# EasyEDA Pro project RFID_Auth_ESP32_Achyuth_PCB_chargeMOD.epro

# Board 1-PCB_PCB_RFID_Auth_ESP32
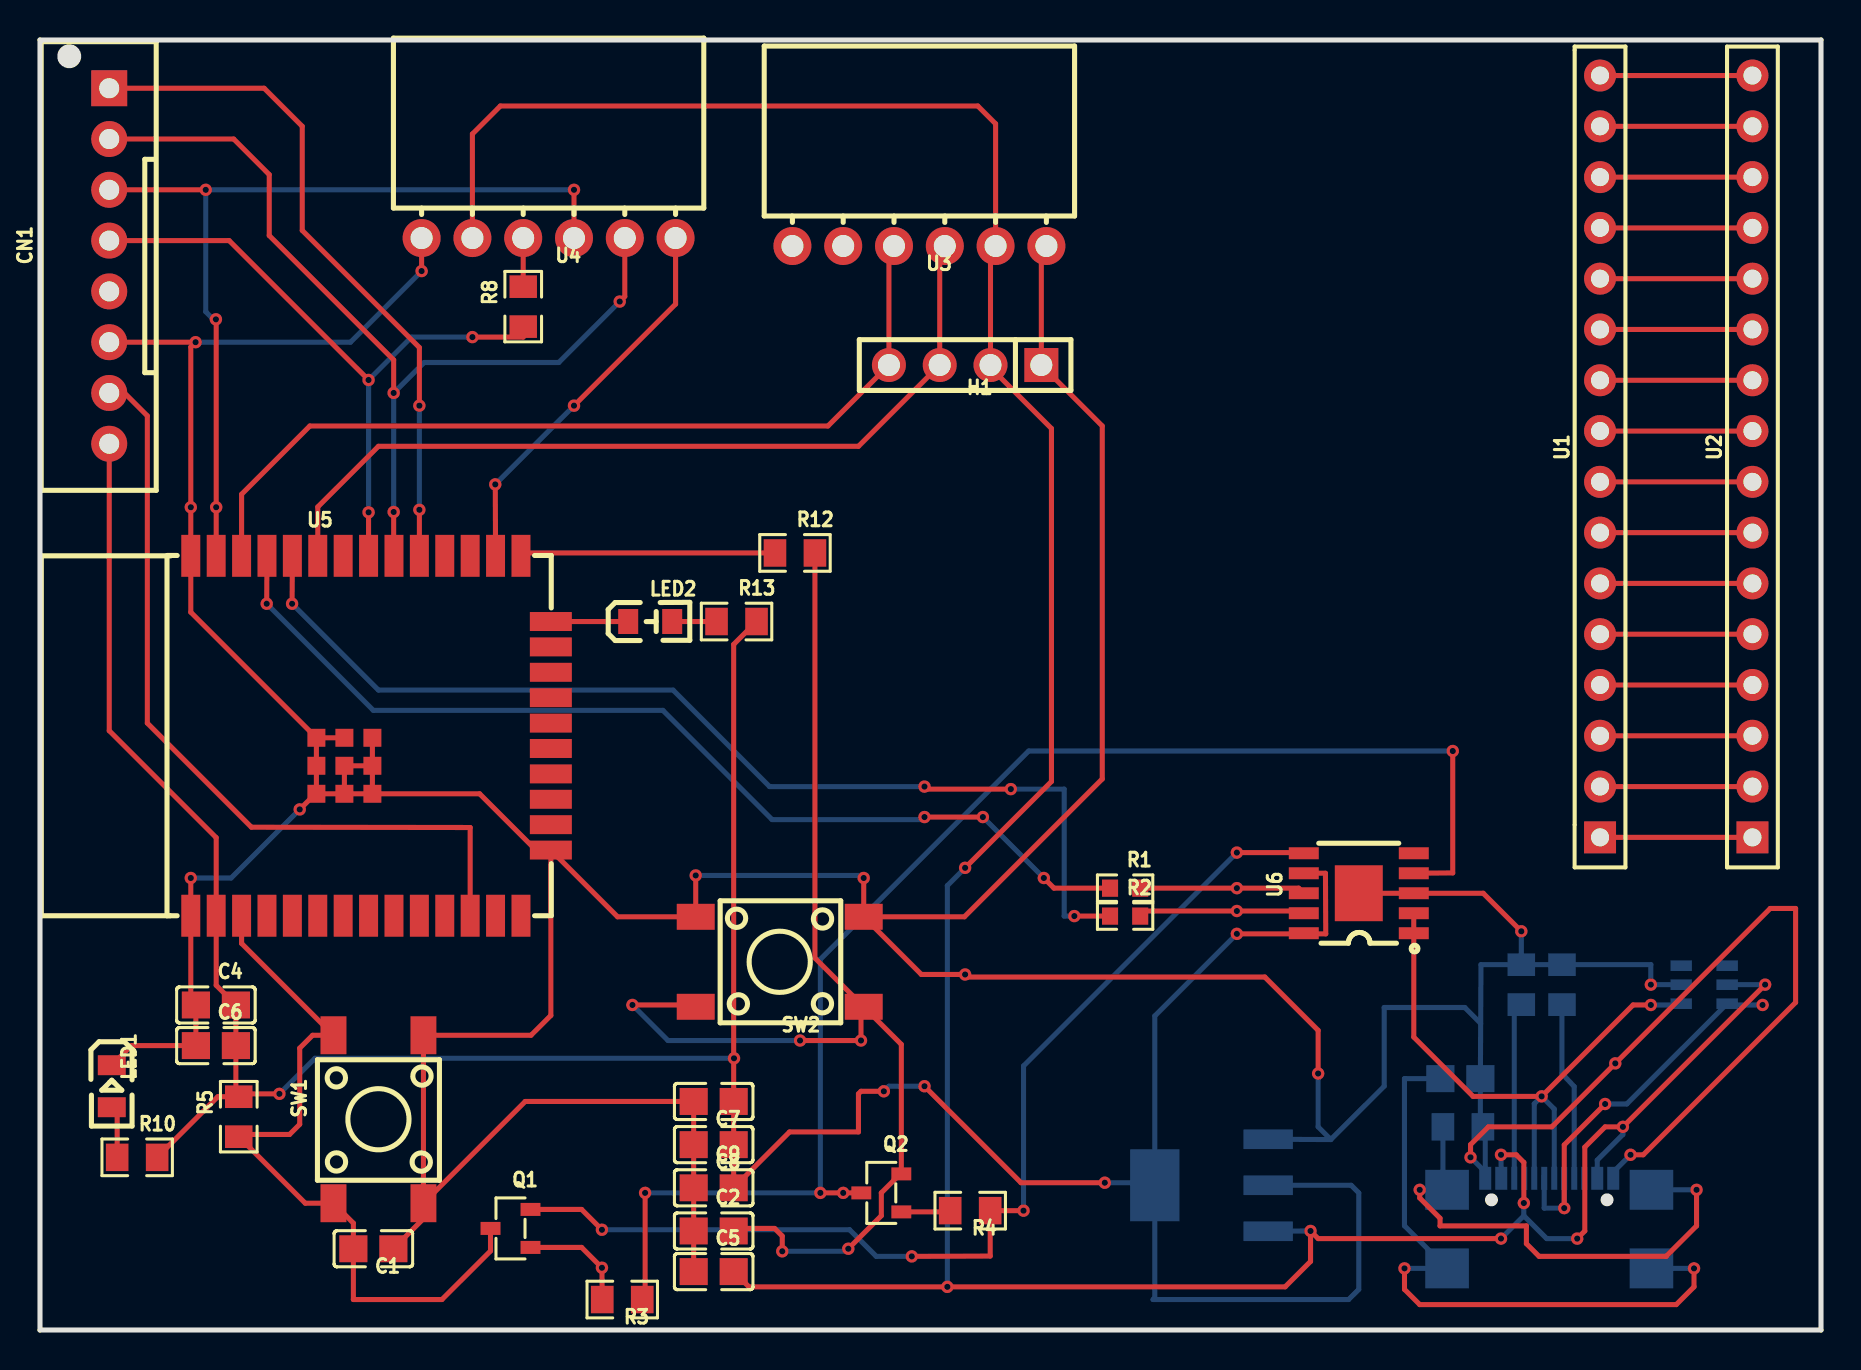
[diagram p0: board, top side]
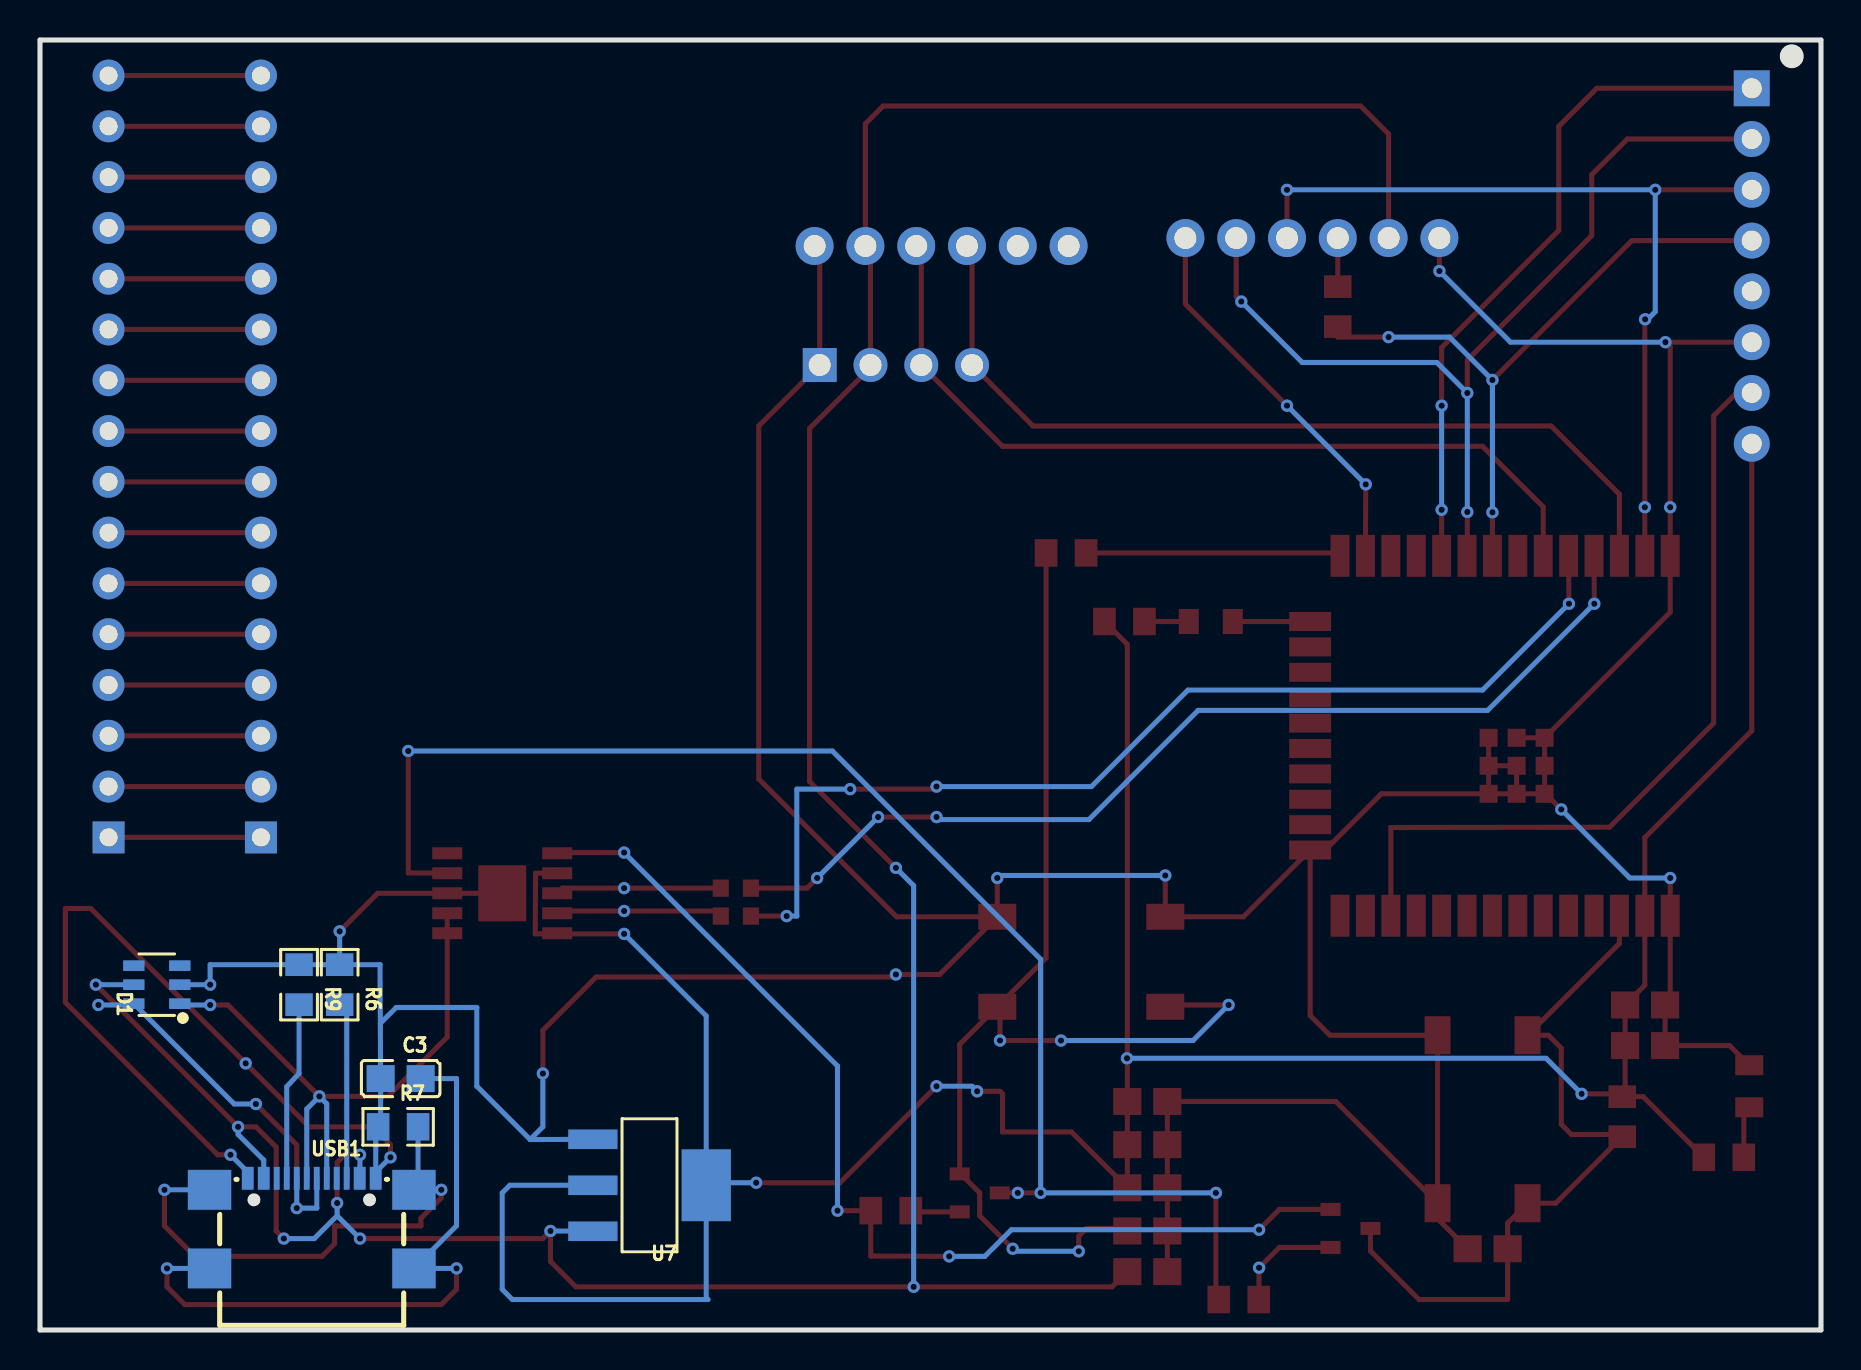
[diagram p1: board, bottom side, seen from below]

Outline 89.06 x 64.52 mm; copper layers: Top Layer, Inner1, Inner2, Bottom Layer. Coordinates in mm from the lower left corner of the outline.
Outline path: 0,64.52 89.06,64.52 89.06,0 0,0 0,64.52
Stack: Top Layer 0.035mm / Bottom Layer 0.035mm

## Design rules (mm)
spacing Default (default): track to track 0.102, other pairs 0 to 0.3
track width Default (default): min 0.254, default 0.254, max 25.4
differential pair differentialPair (default): width min 0.127, default 2.54, max 2.54; gap min 0.127, default 0.152

## Placement (name value [footprint] x y rotation side)
C1  100nF  [C0805]  16.67 4.06 180 top
C2  100nF  [C0805]  33.69 4.95 0 top
C3  10nF  [C0805]  71.03 12.57 180 bottom
C4  100nF  [C0805]  8.8 16.26 0 top
C5  10uF  [C0805]  33.69 2.92 0 top
C6  22uF  [C0805]  8.8 14.22 0 top
C7  100nF  [C0805]  33.69 11.43 180 top
C8  100nF  [C0805]  33.69 9.27 180 top
C9  10uF  [C0805]  33.69 7.11 0 top
CN1  B8B-XH-AM (LF)(SN)  [CONN-TH_B8B-XH-AM-LF-SN]  3.46 53.21 90 top
D1  SRV05-4_C2836319  [SOT-23-6_L2.9-W1.6-P0.95-LS2.8-BL]  83.22 17.27 90 bottom
H1  2.54-1*4P母  [HDR-TH_4P-P2.54-V-F]  46.26 48.26 180 top
LED1  0805G (Green)  [LED0805-R-RD]  3.59 12.19 270 top
LED2  FC-2012HRK-620D  [LED0805-RD]  30.51 35.43 0 top
Q1  SS8050-G  [SOT-23-3_L2.9-W1.3-P1.90-LS2.4-BR]  23.53 5.08 0 top
Q2  SS8050-G  [SOT-23-3_L2.9-W1.3-P1.90-LS2.4-BR]  42.07 6.86 0 top
R1  0Ω  [R0603]  54.26 22.1 0 top
R2  0Ω  [R0603]  54.26 20.7 0 top
R3  10kΩ  [R0805]  29.12 1.52 180 top
R4  10kΩ  [R0805]  46.51 5.97 180 top
R5  10kΩ  [R0805]  9.94 10.67 90 top
R6  5.1kΩ  [R0805]  74.07 17.27 270 bottom
R7  1MΩ  [R0805]  71.15 10.16 180 bottom
R8  220Ω  [R0805]  24.16 51.18 90 top
R9  5.1kΩ  [R0805]  76.11 17.27 270 bottom
R10  5.1kΩ  [R0805]  4.86 8.64 0 top
R12  22Ω  [R0805]  37.75 38.86 0 top
R13  560Ω  [R0805]  34.83 35.43 0 top
SW1  PTS645SH50SMTR92LFS  [KEY-SMD_4P-L6.0-W6.0-P4.50-LS9.0]  16.92 10.54 90 top
SW2  PTS645SH50SMTR92LFS  [KEY-SMD_4P-L6.0-W6.0-P4.50-LS9.0]  36.99 18.41 180 top
U1  ZX-PM2.54-1-16PY  [HDR-TH_16P-P2.54-V-F-1]  78.01 43.69 90 top
U2  ZX-PM2.54-1-16PY  [HDR-TH_16P-P2.54-V-F-1]  85.63 43.69 90 top
U3  PM254-1-06-W-8.5  [HDR-TH_6P-P2.54-H-F-W10.0-N]  43.97 54.21 180 top
U4  PM254-1-06-W-8.5  [HDR-TH_6P-P2.54-H-F-W10.0-N]  25.43 54.61 180 top
U5  ESP32-WROOM-32E(8MB)  [WIFI-SMD_ESP32-WROOM-32E]  16.54 29.72 0 top
U6  CH340K  [ESOP-10_L4.9-W3.9-P1.00-LS6.2-BL-EP]  65.95 21.84 90 top
U7  AMS1117-3.3_C347222  [SOT-223-4_L6.5-W3.5-P2.30-LS7.0-BR]  58.58 7.24 0 bottom
USB1  USB4110-GF-A  [USB-C-SMD_TYPE-C-16P-USB4110-GF-A]  75.47 5.33 180 bottom

## Footprints (pads in the part's own frame, mm; a bottom-side part is the same pattern mirrored in y, then rotated)
C0805
  rect 1.41x1.35 smd: 1(-1,0) 2(1,0)
CONN-TH_B8B-XH-AM-LF-SN
  rect 1.8x1.8 hole 1: 1(8.89,0)
  round 1.8 hole 1: 2(6.35,0) 3(3.81,0) 4(1.27,0) 5(-1.27,0) 6(-3.81,0) 7(-6.35,0) 8(-8.89,0)
ESOP-10_L4.9-W3.9-P1.00-LS6.2-BL-EP
  rect 0.6x1.5 smd: 1(-2.001,-2.75) 2(-1,-2.75) 3(-0.001,-2.75) 4(1,-2.75) 5(2,-2.75) 6(2,2.75) 7(1,2.75) 8(-0.001,2.75) 9(-1,2.75) 10(-2.001,2.75)
  rect 2.8x2.4 smd: 11(-0.001,0)
HDR-TH_4P-P2.54-V-F
  rect 1.7x1.7 hole 1.1: 1(-3.81,0)
  round 1.7 hole 1.1: 2(-1.27,0) 3(1.27,0) 4(3.81,0)
HDR-TH_6P-P2.54-H-F-W10.0-N
  round 1.9 hole 1.1: 1(-6.35,0) 2(-3.81,0) 3(-1.27,0) 4(1.27,0) 5(3.81,0) 6(6.35,0)
HDR-TH_16P-P2.54-V-F-1
  rect 1.6x1.6 hole 0.9: 1(-19.05,0)
  round 1.6 hole 0.9: 2(-16.509,0) 3(-13.97,0) 4(-11.43,0) 5(-8.889,0) 6(-6.349,0) 7(-3.809,0) 8(-1.27,0) 9(1.27,0) 10(3.811,0) 11(6.351,0) 12(8.89,0) 13(11.431,0) 14(13.97,0) 15(16.511,0) 16(19.05,0)
KEY-SMD_4P-L6.0-W6.0-P4.50-LS9.0
  rect 1.9x1.3 smd: 1(-4.2,2.25) 2(4.2,2.25) 3(-4.2,-2.25) 4(4.2,-2.25)
LED0805-R-RD
  rect 1x1.399 smd: 1(1.05,0) 2(-1.05,0)
LED0805-RD
  rect 1x1.25 smd: 1(-1.1,0) 2(1.1,0)
R0603
  rect 0.806x0.864 smd: 1(-0.753,0) 2(0.753,0)
R0805
  rect 1.133x1.377 smd: 1(-1,0) 2(1,0)
SOT-23-3_L2.9-W1.3-P1.90-LS2.4-BR
  rect 1x0.65 smd: 1(1,-0.95) 2(1,0.95) 3(-1,0)
SOT-23-6_L2.9-W1.6-P0.95-LS2.8-BL
  rect 0.532x1.072 smd: 1(-0.95,-1.149) 2(0,-1.149) 3(0.95,-1.149) 4(0.95,1.149) 5(0,1.149) 6(-0.95,1.149)
SOT-223-4_L6.5-W3.5-P2.30-LS7.0-BR
  rect 2.47x0.98 smd: 1(2.835,-2.3) 2(2.835,0) 3(2.835,2.3)
  rect 2.47x3.6 smd: 4(-2.835,0)
USB-C-SMD_TYPE-C-16P-USB4110-GF-A
  rect 2.18x2 smd: 8(-5.11,1.677) 9(5.11,1.677) 10(-5.11,-2.252) 11(5.11,-2.252)
  rect 0.6x1.15 smd: A1B12(-3.2,2.252) A4B9(-2.4,2.252) B1A12(3.2,2.252) B4A9(2.4,2.252)
  rect 0.3x1.15 smd: A5(-1.25,2.252) A6(-0.25,2.252) A7(0.25,2.252) A8(1.25,2.252) B5(1.75,2.252) B6(0.75,2.252) B7(-0.75,2.252) B8(-1.75,2.252)
WIFI-SMD_ESP32-WROOM-32E
  rect 0.95x2.1 smd: 1(-9.002,-9) 2(-7.732,-9) 3(-6.463,-9) 4(-5.192,-9) 5(-3.922,-9) 6(-2.652,-9) 7(-1.383,-9) 8(-0.113,-9) 9(1.157,-9) 10(2.428,-9) 11(3.697,-9) 12(4.968,-9) 13(6.237,-9) 14(7.508,-9) 25(7.508,9) 26(6.237,9) 27(4.968,9) 28(3.697,9) 29(2.428,9) 30(1.157,9) 31(-0.113,9) 32(-1.383,9) 33(-2.652,9) 34(-3.922,9) 35(-5.192,9) 36(-6.463,9) 37(-7.732,9) 38(-9.002,9)
  rect 2.1x0.95 smd: 15(9.002,-5.715) 16(9.002,-4.445) 17(9.002,-3.175) 18(9.002,-1.905) 19(9.002,-0.635) 20(9.002,0.635) 21(9.002,1.905) 22(9.002,3.175) 23(9.002,4.445) 24(9.002,5.715)
  rect 0.9x0.9 smd: 39(-2.721,-0.1) 39(-2.721,-1.5) 39(-2.721,-2.9) 39(-1.321,-0.1) 39(-1.321,-1.5) 39(-1.321,-2.9) 39(0.079,-0.1) 39(0.079,-1.5) 39(0.079,-2.9)

## Nets
+3V3: C4.2 C6.2 C7.1 C8.1 C9.2 CN1.8 R5.2 R10.2 R13.2 U5.2 U6.7 U6.10 U7.2 U7.4
+5V: C5.2 D1.5 H1.2 U3.2 U4.5 U7.3 USB1.A4B9 USB1.B4A9
GND: C1.1 C2.1 C3.1 C4.1 C5.1 C6.1 C7.2 C8.2 C9.1 CN1.6 D1.2 H1.1 LED1.2 R6.1 R7.1 R9.1 SW1.3 SW1.4 SW2.3 SW2.4 U3.1 U4.6 U5.1 U5.15 U5.38 U5.39 U6.3 U6.11 U7.1 USB1.A1B12 USB1.B1A12
DTR: Q2.3 R3.1 U6.4
EN: C1.2 Q1.3 R5.1 SW1.1 SW1.2 U5.3
IO0_BTN: C2.2 Q2.2 R12.2 SW2.1 SW2.2
IO2: LED2.1 U5.24
MISO: CN1.4 R8.1 U5.31
MOSI: CN1.3 U4.3 U5.37
R3_2: Q1.1 R3.2
R4_2: Q2.1 R4.2
R10_1: LED1.1 R10.1
R13_1: LED2.2 R13.1
RFID_CS: CN1.1 U5.29
RST: CN1.7 U5.12
RTS: Q1.2 R4.1 U6.6
RXD: R1.2 U6.8
RXD0: R2.1 U5.34
S$6202: USB1.B8
SCK: CN1.2 U4.2 U5.30
SCL: H1.4 U3.4 U5.36
SD_CS: U4.1 U5.26
SDA: H1.3 U3.3 U5.33
TXD: R2.2 U6.9
TXD0: R1.1 U5.35
U1_1: U1.1 U2.1
U1_2: U1.2 U2.2
U1_3: U1.3 U2.3
U1_4: U1.4 U2.4
U1_5: U1.5 U2.5
U1_6: U1.6 U2.6
U1_7: U1.7 U2.7
U1_8: U1.8 U2.8
U1_9: U1.9 U2.9
U1_10: U1.10 U2.10
U1_11: U1.11 U2.11
U1_12: U1.12 U2.12
U1_13: U1.13 U2.13
U1_14: U1.14 U2.14
U1_15: U1.15 U2.15
U1_16: U1.16 U2.16
U4_4: R8.2 U4.4
U5_25: R12.1 U5.25
USB1_8: R7.2 USB1.8 USB1.9
USB1_10: C3.2 USB1.10 USB1.11
USB1_A5: R9.2 USB1.A5
USB1_B5: R6.2 USB1.B5
USB_DN: D1.6 USB1.A7 USB1.B7
USB_DP: D1.1 U6.1 U6.2 USB1.A6 USB1.B6

Pads without a net: CN1 5; D1 3 4; U3 5 6; U5 4 5 6 7 8 9 10 11 13 14 16 17 18 19 20 21 22 23 27 28 32; U6 5; USB1 A8

## Via types
v1: diameter 0.62, hole 0.31, Top Layer to Bottom Layer, 76 vias

## Routing (per net, layer and track width the routed paths; a pad name or vN(x,y) marks a point on that pad's centre or on a via; arc(x,y) is an arc through that point)
+3V3: length 170.1
  Top Layer w0.254: R5.2 10.08,11.81 v1(11.97,11.81) ; R5.2 8.89,11.67 R10.2 ; R5.2 9.8,11.81 C6.2 C4.2 8.81,17.24 U5.2 8.81,24.62 3.46,29.97 CN1.8 ; v1(42.2,11.94) 41.05,11.94 40.93,11.81 40.93,9.91 37.48,9.91 C9.2 C8.1 C7.1 34.69,34.29 R13.2 ; 63.19,19.84 63.23,19.81 64.29,19.81 64.28,22.84 63.19,22.84 ; v1(59.85,19.81) 63.16,19.81 U6.10 ; v1(44.23,12.19) 49.06,7.37 v1(53.25,7.37)
  Bottom Layer w0.254: v1(34.7,13.59) 13.75,13.59 v1(11.97,11.81) ; v1(59.85,19.81) 55.75,15.71 U7.4 55.75,1.61 55.66,1.52 65.44,1.52 65.95,2.03 65.95,6.86 65.56,7.24 U7.2 ; v1(53.25,7.37) 55.75,7.37 55.75,7.24 ; v1(42.2,11.94) 42.45,12.19 v1(44.23,12.19)
+5V: length 169
  Top Layer w0.254: U4.5 21.62,59.82 23.02,61.21 46.9,61.21 47.78,60.32 U3.2 47.53,53.96 H1.2 47.53,48.13 50.58,45.08 50.58,27.43 v1(46.26,23.11) ; v1(73.06,4.57) 63.91,4.57 v1(63.53,4.95) 63.53,3.43 62.26,2.16 v1(45.37,2.16) 35.45,2.16 C5.2 ; v1(76.87,4.57) 77.25,4.95 77.25,9.14 78.26,10.16 v1(79.15,10.16) v1(86.27,17.27) ; v1(74.2,6.35) 74.2,8.38 73.82,8.76 v1(73.06,8.76)
  Bottom Layer w0.254: v1(79.15,10.16) 79.15,9.78 77.87,8.5 USB1.A4B9 ; 61.41,4.94 v1(63.53,4.95) ; v1(76.87,4.57) 75.34,4.57 74.2,5.72 ; v1(46.26,23.11) 45.37,22.22 v1(45.37,2.16) ; 74.2,5.72 v1(73.06,4.57) ; 74.2,5.72 v1(74.2,6.35) ; D1.5 v1(86.27,17.27) ; v1(73.06,8.76) 73.07,7.59
GND: length 319.4
  Top Layer w0.254: v1(74.07,19.94) 72.17,21.84 U6.3 U6.11 ; SW1.3 19.17,5.57 C1.1 ; SW1.3 24.26,11.43 C7.2 C8.2 C9.1 C2.1 C5.1 ; SW1.3 SW1.4 ; LED1.2 4.57,14.22 C6.1 C4.1 7.54,16.51 U5.1 v1(7.54,22.61) ; U5.39 13.77,26.82 v1(12.99,26.03) ; U5.39 U5.39 ; U5.39 U5.39 U5.39 ; 19.17,14.74 24.55,14.74 25.55,15.73 25.55,24 ; U5.39 U5.39 ; U5.39 21.98,26.82 24.8,24 U5.15 28.88,20.66 SW2.4 v1(32.79,22.73) ; U5.39 U5.39 ; U5.39 U5.39 ; U5.39 U5.39 U5.39 ; U5.39 7.54,35.9 U5.38 v1(7.54,41.15) 7.54,49.16 v1(7.78,49.4) CN1.6 ; U5.39 U5.39 ; v1(79.53,8.76) 80.17,8.76 87.79,16.38 87.79,21.08 86.52,21.08 v1(78.77,13.33) 75.6,10.16 72.42,10.16 71.53,9.27 v1(71.53,8.64) ; U4.6 v1(19.08,52.96) ; U3.1 50.07,53.96 H1.1 53.12,45.21 53.12,27.56 46.22,20.66 SW2.3 ; SW2.3 44.07,17.78 v1(46.26,17.78) 46.39,17.65 61.25,17.65 63.91,14.99 v1(63.91,12.83) ; SW2.3 v1(41.19,22.61)
  Bottom Layer w0.254: v1(19.08,52.96) 15.53,49.4 v1(7.78,49.4) ; v1(79.53,8.76) 78.67,7.9 USB1.A1B12 ; v1(63.91,12.83) 63.91,10.16 64.55,9.53 ; D1.2 v1(80.55,17.27) 80.55,18.27 76.11,18.27 ; v1(71.53,8.64) 72.27,7.9 USB1.B1A12 72.27,10.04 R7.1 72.03,10.29 C3.1 ; 61.41,9.54 64.55,9.53 ; 64.55,9.53 67.22,12.19 67.22,16.13 71.25,16.13 72.04,15.33 ; 74.07,18.27 72.06,18.27 72.03,12.57 ; v1(7.54,22.61) 9.56,22.61 v1(12.99,26.03) ; v1(41.19,22.61) 41.06,22.73 v1(32.79,22.73) ; R9.1 R6.1 v1(74.07,19.94)
DTR: length 71.9
  Top Layer w0.254: v1(39.02,6.86) v1(40.16,6.86) Q2.3 ; R3.1 30.26,1.67 v1(30.26,6.86) ; v1(70.64,28.96) 70.64,22.86 68.7,22.84
  Bottom Layer w0.254: v1(70.64,28.96) 49.44,28.96 39.02,18.54 v1(39.02,6.86) v1(30.26,6.86)
EN: length 37.3
  Top Layer w0.254: U5.3 10.08,19.33 SW1.2 13.63,14.74 12.99,14.1 12.99,10.29 12.48,9.78 10.05,9.78 R5.1 13.27,6.34 SW1.1 15.67,5.34 C1.2 15.67,1.52 20.1,1.52 22.53,3.95 Q1.3
IO0_BTN: length 61.7
  Top Layer w0.254: C2.2 34.81,5.08 36.74,5.08 37.12,4.7 v1(37.12,3.94) ; SW2.1 38.75,18.6 R12.2 ; SW2.1 43.07,14.28 Q2.2 43.02,7.81 42.07,6.86 42.07,5.72 v1(40.42,4.06) ; SW2.1 41.05,16.03 v1(41.05,14.48) v1(38.01,14.48) ; v1(29.62,16.26) 32.7,16.26 SW2.2
  Bottom Layer w0.254: v1(37.12,3.94) 40.42,3.94 v1(40.42,4.06) ; v1(38.01,14.48) 31.4,14.48 v1(29.62,16.26)
IO2: length 3.9
  Top Layer w0.254: 29.41,35.43 U5.24
MISO: length 33.8
  Top Layer w0.254: v1(21.62,49.66) 24.16,49.66 24.16,50.18 ; CN1.4 9.46,54.48 16.43,47.51 ; U5.31 v1(16.43,40.89)
  Bottom Layer w0.254: v1(16.43,40.89) v1(16.43,47.51) 18.58,49.66 v1(21.62,49.66)
MOSI: length 44.3
  Top Layer w0.254: U4.3 v1(26.7,57.02) ; U5.37 v1(8.81,41.15) 8.81,50.55 v1(8.8,50.55) ; CN1.3 v1(8.29,57.02)
  Bottom Layer w0.254: v1(8.8,50.55) 8.67,50.55 8.29,50.93 v1(8.29,57.02) v1(26.7,57.02)
R3_2: length 5.6
  Top Layer w0.254: Q1.1 27.08,4.13 v1(28.1,3.11) R3.2
R4_2: length 2.5
  Top Layer w0.254: Q2.1 45.45,5.91 R4.2
R10_1: length 2.6
  Top Layer w0.254: R10.1 3.86,10.87 LED1.1
R13_1: length 2.2
  Top Layer w0.254: LED2.2 R13.1
RFID_CS: length 34.3
  Top Layer w0.254: CN1.1 11.21,62.1 13.11,60.2 13.11,54.99 18.97,49.13 18.97,46.23 ; U5.29 v1(18.97,41.02)
  Bottom Layer w0.254: v1(18.97,41.02) v1(18.97,46.23)
RST: length 40.5
  Top Layer w0.254: CN1.7 4.22,46.86 5.37,45.72 5.37,30.35 10.57,25.15 21.51,25.13 21.51,20.72
RTS: length 53.6
  Top Layer w0.254: U6.6 63.16,23.88 v1(59.85,23.88) ; v1(43.59,3.68) 47.52,3.7 R4.1 v1(49.18,5.97) ; Q1.2 27.08,6.03 v1(28.1,5.01)
  Bottom Layer w0.254: v1(59.85,23.88) 49.18,13.21 v1(49.18,5.97) ; v1(43.59,3.68) 41.82,3.68 40.48,5.01 v1(28.1,5.01)
RXD: length 8.3
  Top Layer w0.254: U6.8 62.94,22.1 v1(59.85,22.1) R1.2
RXD0: length 53.5
  Top Layer w0.254: v1(51.72,20.7) R2.1 ; v1(44.23,27.18) 44.36,27.05 v1(48.55,27.05) ; U5.34 v1(12.61,36.32)
  Bottom Layer w0.254: v1(48.55,27.05) 51.21,27.05 51.21,20.7 v1(51.72,20.7) ; v1(44.23,27.18) 36.48,27.18 31.66,32 16.92,32 v1(12.61,36.32)
SCK: length 46.7
  Top Layer w0.254: 17.69,38.86 v1(17.69,40.91) ; v1(17.69,46.86) 17.69,48.51 11.46,54.74 11.46,57.78 9.69,59.56 CN1.2 ; v1(28.99,51.43) 29.24,51.69 U4.2
  Bottom Layer w0.254: v1(17.69,40.91) v1(17.69,46.86) 19.21,48.39 25.94,48.39 v1(28.99,51.43)
SCL: length 44.2
  Top Layer w0.254: U5.36 10.08,41.8 13.49,45.21 39.4,45.21 H1.4 42.45,53.96 U3.4
SD_CS: length 19.6
  Top Layer w0.254: v1(22.77,42.29) U5.26 ; v1(26.7,46.23) 31.78,51.31 U4.1
  Bottom Layer w0.254: v1(26.7,46.23) v1(22.77,42.29)
SDA: length 42.5
  Top Layer w0.254: 13.89,38.72 13.89,41.16 16.92,44.2 40.93,44.2 H1.3 44.99,53.96 U3.3
TXD: length 8.3
  Top Layer w0.254: R2.2 55.27,20.95 v1(59.85,20.95) 63.09,20.95 U6.9
TXD0: length 50.6
  Top Layer w0.254: 11.35,38.72 v1(11.34,36.32) ; v1(44.23,25.65) v1(47.15,25.65) ; v1(50.2,22.61) 50.71,22.1 R1.1
  Bottom Layer w0.254: v1(44.23,25.65) 44.23,25.53 36.61,25.53 31.15,30.99 16.67,30.99 v1(11.34,36.32) ; v1(47.15,25.65) v1(50.2,22.61)
U1_1: length 7.6
  Top Layer w0.254: U1.1 U2.1
U1_2: length 7.6
  Top Layer w0.254: U1.2 U2.2
U1_3: length 7.6
  Top Layer w0.254: U1.3 U2.3
U1_4: length 7.6
  Top Layer w0.254: U1.4 U2.4
U1_5: length 7.6
  Top Layer w0.254: U1.5 U2.5
U1_6: length 7.6
  Top Layer w0.254: U1.6 U2.6
U1_7: length 7.6
  Top Layer w0.254: U1.7 U2.7
U1_8: length 7.6
  Top Layer w0.254: U1.8 U2.8
U1_9: length 7.6
  Top Layer w0.254: U1.9 U2.9
U1_10: length 7.6
  Top Layer w0.254: U1.10 U2.10
U1_11: length 7.6
  Top Layer w0.254: U1.11 U2.11
U1_12: length 7.6
  Top Layer w0.254: U1.12 U2.12
U1_13: length 7.6
  Top Layer w0.254: U1.13 U2.13
U1_14: length 7.6
  Top Layer w0.254: U1.14 U2.14
U1_15: length 7.6
  Top Layer w0.254: U1.15 U2.15
U1_16: length 7.6
  Top Layer w0.254: U1.16 U2.16
U4_4: length 2.4
  Top Layer w0.254: U4.4 R8.2
U5_25: length 12.8
  Top Layer w0.254: R12.1 24.19,38.86 U5.25
USB1_8: length 25.5
  Top Layer w0.254: v1(68.99,7.01) 68.99,6.6 70.01,5.59 70.01,5.21 74.33,5.21 74.33,4.32 74.96,3.68 81.31,3.68 82.84,5.21 v1(82.84,7.01)
  Bottom Layer w0.254: v1(68.99,7.01) USB1.9 70.15,7.22 R7.2 ; 80.58,7.01 v1(82.84,7.01)
USB1_10: length 33.6
  Top Layer w0.254: v1(82.71,3.08) 82.71,2.16 81.82,1.27 68.99,1.27 68.23,2.03 v1(68.23,3.08)
  Bottom Layer w0.254: 80.58,3.08 v1(82.71,3.08) ; C3.2 68.23,12.57 68.23,5.21 USB1.11 v1(68.23,3.08)
USB1_A5: length 8.9
  Bottom Layer w0.254: R9.2 76.11,12.83 76.72,12.17 76.72,7.59
USB1_B5: length 8.8
  Bottom Layer w0.254: USB1.B5 73.72,15.92 R6.2
USB_DN: length 20.1
  Top Layer w0.254: v1(76.22,6.1) 76.22,9.26 v1(78.26,11.3)
  Bottom Layer w0.254: v1(78.26,11.3) 79.35,11.3 D1.6 84.43,16.26 v1(86.14,16.26) ; 75.22,7.71 75.22,6.1 v1(76.22,6.1) 76.22,7.59
USB_DP: length 31.3
  Top Layer w0.254: v1(80.55,16.26) 79.66,16.26 v1(75.09,11.68) 71.66,11.68 68.7,14.65 68.7,19.84 ; U6.2 U6.1
  Bottom Layer w0.254: v1(80.55,16.26) 82,16.26 D1.1 ; USB1.B6 74.72,11.31 v1(75.09,11.68) 75.72,11.05 USB1.A6
